# Altium project sumo20-hw.PrjPCB
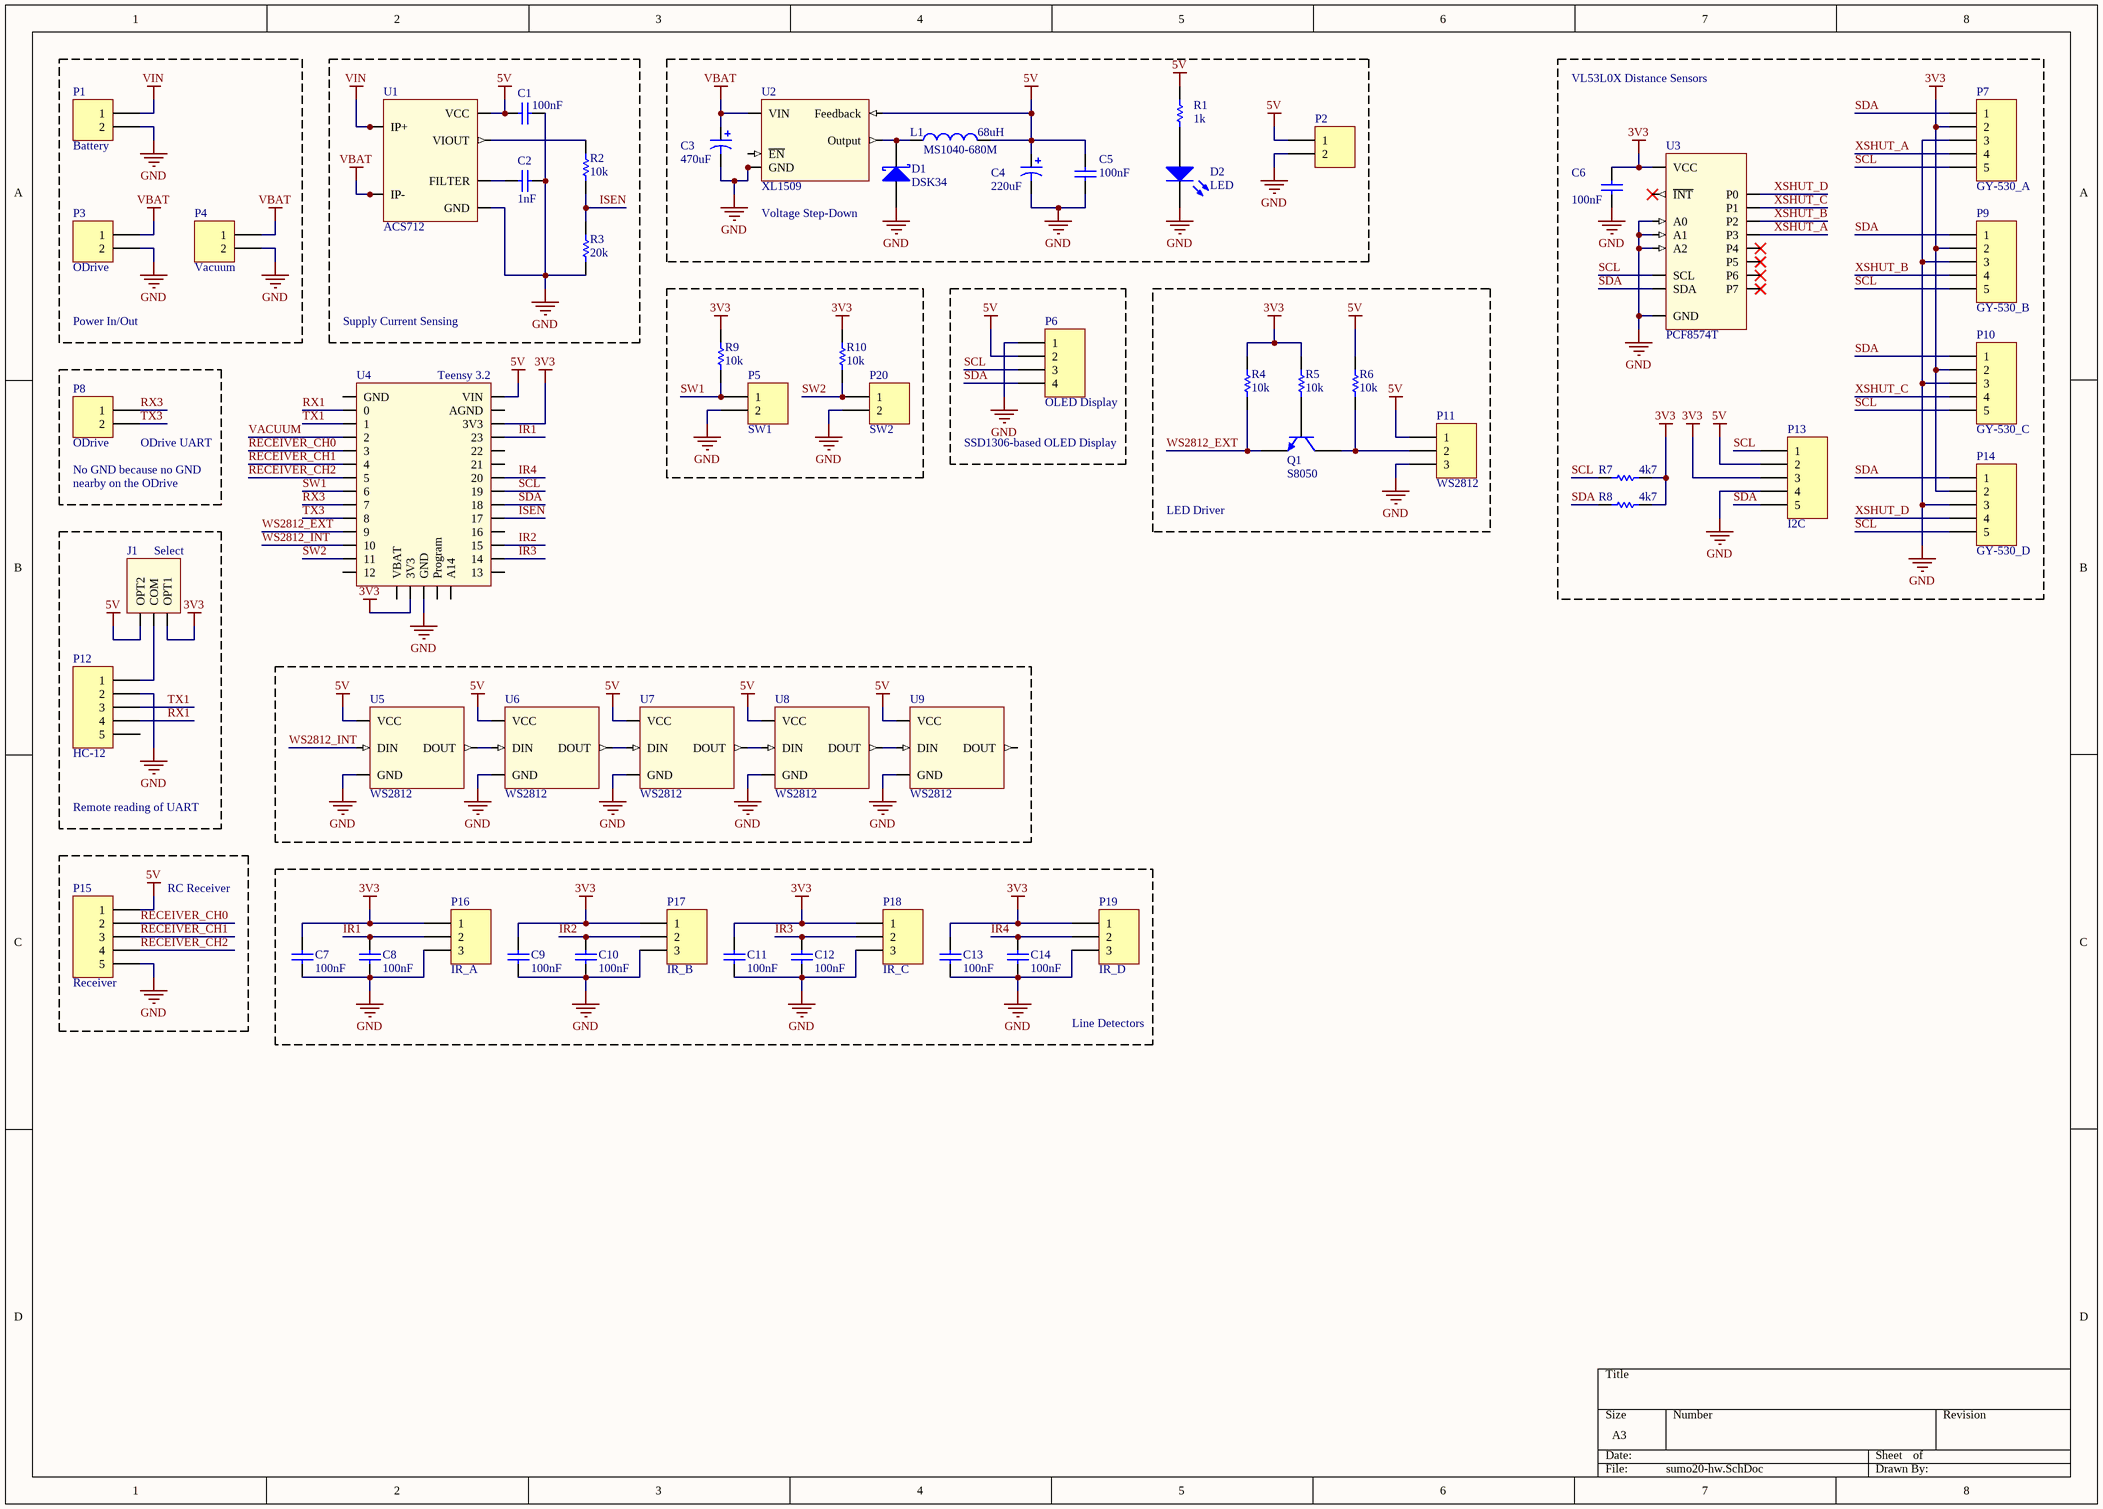
[diagram p0: sumo20-hw.SchDoc]
1 sheet, 58 parts. Net scope: global (net labels, ports and power ports of the same name join across sheets).
Board file: sumo20-hw.PcbDoc

## Sheet sumo20-hw.SchDoc
size A3

### Parts
C1  value 100nF  [J1-0603]  (hidden comment: Cap)
C2  value 1nF  [J1-0603]  (hidden comment: Cap)
C3  value 470uF  [10x10.5]  (hidden comment: Cap Pol1)
C4  value 220uF  [6.3X5.4]  (hidden comment: Cap Pol1)
C5  value 100nF  [J1-0603]  (hidden comment: Cap)
C6  value 100nF  [J1-0603]  (hidden comment: Cap)
C7  value 100nF  [J1-0603]  (hidden comment: Cap)
C8  value 100nF  [J1-0603]  (hidden comment: Cap)
C9  value 100nF  [J1-0603]  (hidden comment: Cap)
C10  value 100nF  [J1-0603]  (hidden comment: Cap)
C11  value 100nF  [J1-0603]  (hidden comment: Cap)
C12  value 100nF  [J1-0603]  (hidden comment: Cap)
C13  value 100nF  [J1-0603]  (hidden comment: Cap)
C14  value 100nF  [J1-0603]  (hidden comment: Cap)
D1  DSK34  [SOD-123FL]
D2  LED  [J1-0603 LED]
J1  Select  [0603-Jumper]
L1  MS1040-680M  value 68uH  [MS1040]
P1  Battery  [Wire Terminals]
P2  5V  [HDR1X2]  (value not drawn)
P3  ODrive  [Wire Terminals]
P4  Vacuum  [Wire Terminals]
P5  SW1  [2541P02]
P6  OLED Display  [HDR1X4]
P7  GY-530_A  [2541P05]
P8  ODrive  [2541P02]
P9  GY-530_B  [2541P05]
P10  GY-530_C  [2541P05]
P11  WS2812  [2541P03]
P12  HC-12  [HDR1X5]
P13  I2C  [HDR1X5]
P14  GY-530_D  [2541P05]
P15  Receiver  [2541P05]
P16  IR_A  [2541P03]
P17  IR_B  [2541P03]
P18  IR_C  [2541P03]
P19  IR_D  [2541P03]
P20  SW2  [2541P02]
Q1  S8050  [SOT23-3M]
R1  value 1k  [J1-0603]  (hidden comment: Res1)
R2  value 10k  [J1-0603]  (hidden comment: Resistor)
R3  value 20k  [J1-0603]  (hidden comment: Resistor)
R4  value 10k  [J1-0603]  (hidden comment: Resistor)
R5  value 10k  [J1-0603]  (hidden comment: Resistor)
R6  value 10k  [J1-0603]  (hidden comment: Resistor)
R7  value 4k7  [J1-0603]  (hidden comment: Resistor)
R8  value 4k7  [J1-0603]  (hidden comment: Resistor)
R9  value 10k  [J1-0603]  (hidden comment: Resistor)
R10  value 10k  [J1-0603]  (hidden comment: Resistor)
U1  ACS712  [SOP8]
U2  XL1509  [SOP8]
U3  PCF8574T  [SOT162-1 (SO16)]
U4  Teensy 3.2  [Teensy 3.2]
U5  WS2812  [WS2812B-Mini]
U6  WS2812  [WS2812B-Mini]
U7  WS2812  [WS2812B-Mini]
U8  WS2812  [WS2812B-Mini]
U9  WS2812  [WS2812B-Mini]

### Blocks framed on the sheet
Power In/Out: P1 P3 P4
Supply Current Sensing: C1 C2 R2 R3 U1
Voltage Step-Down: C3-C5 D1 D2 L1 P2 R1 U2
VL53L0X Distance Sensors: C6 P7 P9 P10 P13 P14 R7 R8 U3
SSD1306-based OLED Display: P6
LED Driver: P11 Q1 R4-R6
Remote reading of UART: J1 P12
RC Receiver: P15
Line Detectors: C7-C14 P16-P19

### Nets
3V3: C6.2 C7.1 C9.1 C11.1 C13.1 J1.1(OPT1) P7.2 P9.2 P10.2 P13.3 P14.2 P16.1 P17.1 P18.1 P19.1 R4.2 R5.2 R7.1 R8.1 R9.2 R10.2 U3.16(VCC) U4.16(3V3) U4.31(3V3)
5V: C1.2 C4.1 C5.2 J1.3(OPT2) L1.2 P2.1 P6.2 P11.1 P13.2 P15.1 R1.2 R6.2 U1.8(VCC) U2.3(Feedback) U4.33(VIN) U5.1(VCC) U6.1(VCC) U7.1(VCC) U8.1(VCC) U9.1(VCC)
GND: C1.1 C2.2 C3.2 C4.2 C5.1 C6.1 C7.2 C8.2 C9.2 C10.2 C11.2 C12.2 C13.2 C14.2 D1.1(A) D2.2(K) P1.2 P2.2 P3.2 P4.2 P5.2 P6.1 P7.3 P9.3 P10.3 P11.3 P12.2 P13.4 P14.3 P15.5 P16.3 P17.3 P18.3 P19.3 P20.2 R3.1 U1.5(GND) U2.5(GND) U2.6(GND) U2.7(GND) U2.8(GND) U3.1(A0) U3.2(A1) U3.3(A2) U3.8(GND) U4.17(GND) U5.3(GND) U6.3(GND) U7.3(GND) U8.3(GND) U9.3(GND)
VBAT: C3.1 P3.1 P4.1 U1.3(IP-) U1.4(IP-) U2.1(VIN)
VIN: P1.1 U1.1(IP+) U1.2(IP+)
IR1: C8.1 P16.2 U4.30(23)
IR2: C10.1 P17.2 U4.22(15)
IR3: C12.1 P18.2 U4.21(14)
IR4: C14.1 P19.2 U4.27(20)
ISEN: R2.2 R3.2 U4.24(17)
RECEIVER_CH0: P15.2 U4.5(3)
RECEIVER_CH1: P15.3 U4.6(4)
RECEIVER_CH2: P15.4 U4.7(5)
RX1: P12.4 U4.2(0)
RX3: P8.1 U4.9(7)
SCL: P6.3 P7.5 P9.5 P10.5 P13.1 P14.5 R7.2 U3.14(SCL) U4.26(19)
SDA: P6.4 P7.1 P9.1 P10.1 P13.5 P14.1 R8.2 U3.15(SDA) U4.25(18)
SW1: P5.1 R9.1 U4.8(6)
SW2: P20.1 R10.1 U4.13(11)
TX1: P12.3 U4.3(1)
TX3: P8.2 U4.10(8)
VACUUM: U4.4(2)
WS2812_EXT: Q1.2(E) R4.1 U4.11(9)
WS2812_INT: U4.12(10) U5.4(DIN)
XSHUT_A: P7.4 U3.7(P3)
XSHUT_B: P9.4 U3.6(P2)
XSHUT_C: P10.4 U3.5(P1)
XSHUT_D: P14.4 U3.4(P0)
NetC2_1: C2.1 U1.6(FILTER)
NetD1_2: D1.2(K) L1.1 U2.2(Output)
NetD2_1: D2.1(A) R1.1
NetJ1_2: J1.2(COM) P12.1
NetP11_2: P11.2 Q1.3(C) R6.1
NetQ1_1: Q1.1(B) R5.1
NetR2_1: R2.1 U1.7(VIOUT)
NetU5_2: U5.2(DOUT) U6.4(DIN)
NetU6_2: U6.2(DOUT) U7.4(DIN)
NetU7_2: U7.2(DOUT) U8.4(DIN)
NetU8_2: U8.2(DOUT) U9.4(DIN)

Not connected (* = marked no-connect by the designer): P12 5; U2 4(~{EN}); U3 9(P4)* 10(P5)* 11(P6)* 12(P7)* 13(~{INT})*; U4 1(GND) 14(12) 15(VBAT) 18(Program) 19(A14) 20(13) 23(16) 28(21) 29(22) 32(AGND); U9 2(DOUT)

### Notes on the sheet
- (near P8) ODrive UART
- (near P8) No GND because no GND
- nearby on the ODrive

### Library data of the parts
C1 C2 C5-C14 = Cap: Capacitor
  C1 C5-C14: Published: 8-Jun-2000; LatestRevisionDate: 17-Jul-2002; LatestRevisionNote: Re-released for DXP Platform.; PackageReference: RAD-0.3; Publisher: Altium Limited; PackageDescription: Radial Cap, Thru-Hole; 2 Leads; 0.3 in Pin Spacing; LCSC: C153795
C3 C4 = Cap Pol1: Polarized Capacitor (Radial); Published: 8-Jun-2000; LatestRevisionDate: 17-Jul-2002; LatestRevisionNote: Re-released for DXP Platform.; PackageReference: RB7.6-15; Publisher: Altium Limited; PackageDescription: Polarized Capacitor (Radial); 2 Leads
  C3: LCSC: C280413
  C4: LCSC: C131157
D1 = D Schottky: Schottky Diode; Published: 8-Jun-2000; LatestRevisionDate: 17-Jul-2002; LatestRevisionNote: Re-released for DXP Platform.; PackageReference: SMB; Publisher: Altium Limited; PackageDescription: DO-214-AA/SMB; 2 C-Bend Leads; Body 5.3 x 3.6 mm, inc. leads (LxW); Code_JEDEC: DO-214-AA; LCSC: C41029
J1 = Select Jumper
L1 = Inductor: Code_IEC: 1005; Published: 8-Jun-2000; LatestRevisionDate: 29-May-2009; LatestRevisionNote: IPC-7351 Footprint Added.; PackageReference: 0402-A; Publisher: Altium Limited; PackageDescription: Chip Inductor; Code_JEITA: 0402; LCSC: C380058
P1-P5 P8 P20 = Header 2: Header, 2-Pin; LatestRevisionDate: 17-Jul-2002; LatestRevisionNote: Re-released for DXP Platform.; Publisher: Altium Limited
P6 = Header 4: Header, 4-Pin; LatestRevisionDate: 17-Jul-2002; LatestRevisionNote: Re-released for DXP Platform.; Publisher: Altium Limited
P7 P9 P10 P12-P15 = Header 5: Header, 5-Pin; LatestRevisionDate: 17-Jul-2002; LatestRevisionNote: Re-released for DXP Platform.; Publisher: Altium Limited
P11 P16-P19 = Header 3: Header, 3-Pin; LatestRevisionDate: 17-Jul-2002; LatestRevisionNote: Re-released for DXP Platform.; Publisher: Altium Limited
Q1 = S8050: NPN General Purpose Amplifier; Published: 8-Jun-2000; LatestRevisionDate: 15-Jan-2003; LatestRevisionNote: PCB Footprint 'BCY-W3/D4.7' replaced; DatasheetVersion: 1997; PackageVersion: Sep-1998; PackageReference: TO-92A; Publisher: Altium Limited; PackageDescription: TO, Flat Index; 3 In-Line, Axial Leads; Body Dia. 4.5mm; Leads 0.51 x 0.48 mm (max)
R1 = Res1: Resistor; Published: 8-Jun-2000; LatestRevisionDate: 17-Jul-2002; LatestRevisionNote: Re-released for DXP Platform.; PackageReference: AXIAL-0.3; Publisher: Altium Limited; PackageDescription: Axial Device, Thru-Hole; 2 Leads; 0.3 in Pin Spacing
U1 = ACS712: Fully Integrated, Hall Effect-Based Linear Current Sensor with 2.1 kVRMS Voltage Isolation and a Low-Resistance Current Conductor
U3 = PCF8574T: Remote 8-Bit I/O Expander for I2C Bus
D2 = LED: Published: 8-Jun-2000; LatestRevisionDate: 17-Jul-2002; LatestRevisionNote: Re-released for DXP Platform.; PackageVersion: Feb-2002; PackageReference: 3.2X1.6X1.1; Publisher: Altium Limited; PackageDescription: SM LED; 2 Flat Leads; LCSC: C205450
R2-R10 = Resistor: Published: 8-Jun-2000; LatestRevisionDate: 17-Jul-2002; LatestRevisionNote: Re-released for DXP Platform.; PackageReference: AXIAL-0.3; Publisher: Altium Limited; PackageDescription: Axial Device, Thru-Hole; 2 Leads; 0.3 in Pin Spacing
U2 = XL1509: LCSC: C61063